# EAGLE schematic Schaltplan (EAGLE 9.6.2)

## Sheet 1 of 2
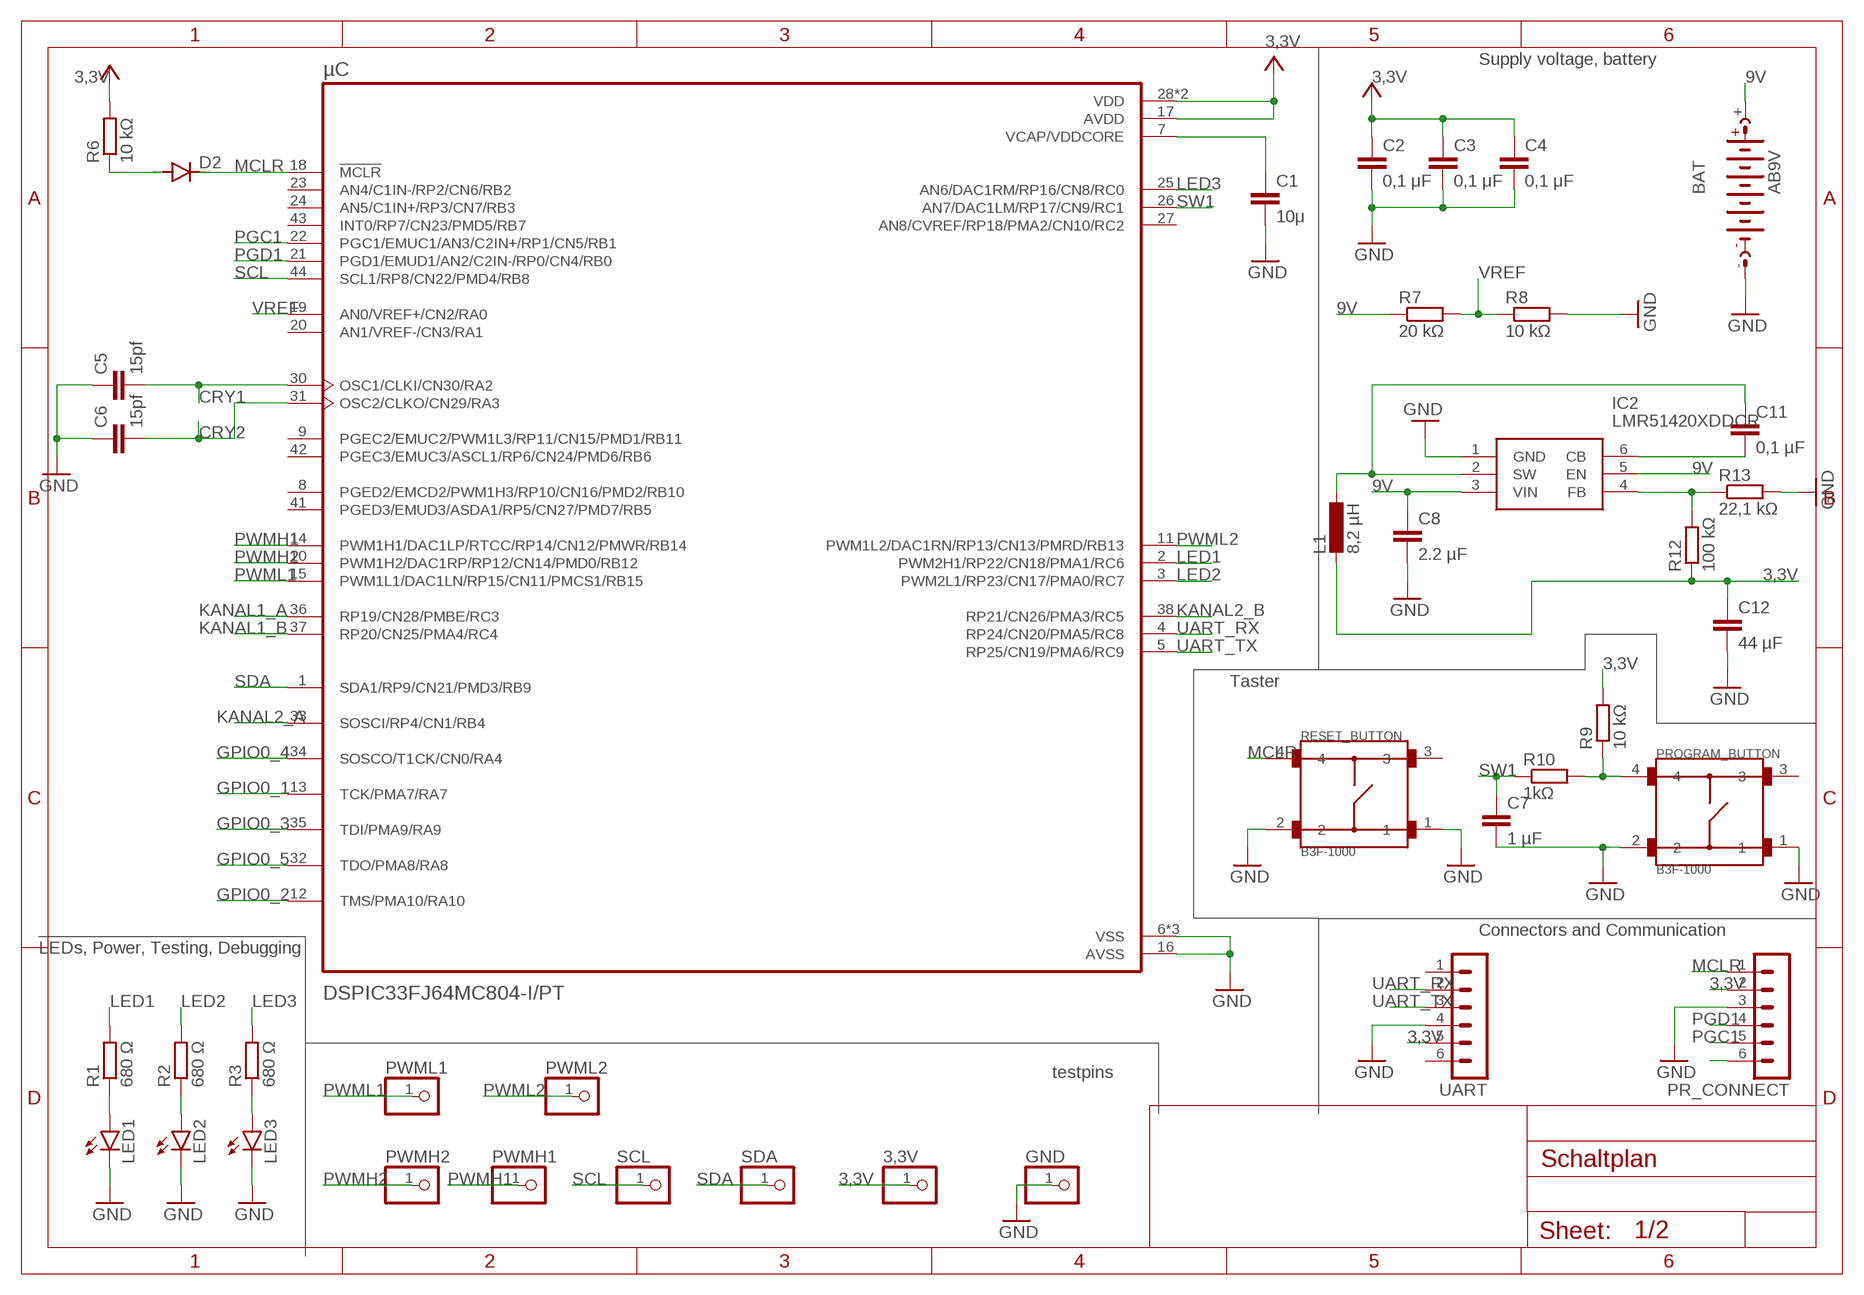
[diagram p0: schematic, sheet 1]

### Parts
3,3V  PINHD-1X1  [1X01]
BAT  AB9V  [AB9V]
C1  10μ  C-EUC0805  [C0805]
C2  0,1 μF  C-EUC0805  [C0805]
C3  0,1 μF  C-EUC0805  [C0805]
C4  0,1 μF  C-EUC0805  [C0805]
C5  15pf  C-EUC0805  [C0805]
C6  15pf  C-EUC0805  [C0805]
C7  1 µF  C-EUC0805  [C0805]
C8  2.2 µF  C-EUC0805  [C0805]
C11  0,1 µF  C-EUC0805  [C0805]
C12  44 µF  C-EUC0805  [C0805]
D2  DIODE-DO-214AC  [DO-214AC]
GND  PINHD-1X1  [1X01]
IC2  LMR51420XDDCR  [SOT95P280X110-6N]
L1  8,2 µH  L-EUL0201  [L0201]
LED1  LEDCHIPLED_0805  [CHIPLED_0805]
LED2  LEDCHIPLED_0805  [CHIPLED_0805]
LED3  LEDCHIPLED_0805  [CHIPLED_0805]
PR_CONNECT  MA06-1  [MA06-1]
PROGRAM_BUTTON  B3F-1000  [SW_B3F-1000]
PWMH1  PINHD-1X1  [1X01]
PWMH2  PINHD-1X1  [1X01]
PWML1  PINHD-1X1  [1X01]
PWML2  PINHD-1X1  [1X01]
R1  680 Ω  R-EU_R0805  [R0805]
R2  680 Ω  R-EU_R0805  [R0805]
R3  680 Ω  R-EU_R0805  [R0805]
R6  10 kΩ  R-EU_R0805  [R0805]
R7  20 kΩ  R-EU_R0805  [R0805]
R8  10 kΩ  R-EU_R0805  [R0805]
R9  10 kΩ  R-EU_R0805  [R0805]
R10  1kΩ  R-EU_R0805  [R0805]
R12  100 kΩ  R-EU_R0805  [R0805]
R13  22,1 kΩ  R-EU_R0805  [R0805]
RESET_BUTTON  B3F-1000  [SW_B3F-1000]
SCL  PINHD-1X1  [1X01]
SDA  PINHD-1X1  [1X01]
UART  MA06-1  [MA06-1]
µC  DSPIC33FJ64MC804-I/PT  [QFP80P1200X1200X120-44N]

### Nets
3,3V: 3,3V.1 C2.1 C3.1 C4.1 C12.1 L1.2 PR_CONNECT.2 R6.2 R9.2 R12.1 UART.5 µC.17(AVDD) µC.28(VDD) µC.40(VDD) ; supply symbol labelled VCC ; also sheet 2
9V: BAT.+ C8.1 IC2.3(VIN) IC2.5(EN) R7.1 ; also sheet 2
CRY1: C5.2 µC.30(OSC1/CLKI/CN30/RA2) ; also sheet 2
CRY2: C6.2 µC.31(OSC2/CLKO/CN29/RA3) ; also sheet 2
GND: BAT.- C1.2 C2.2 C3.2 C4.2 C5.1 C6.1 C7.2 C8.2 C12.2 GND.1 IC2.1(GND) LED1.C LED2.C LED3.C PR_CONNECT.3 PROGRAM_BUTTON.1 PROGRAM_BUTTON.2 R8.2 R13.2 RESET_BUTTON.1 RESET_BUTTON.2 UART.4 µC.6(VSS) µC.16(AVSS) µC.29(VSS) µC.39(VSS) ; also sheet 2
GPIO0_1: µC.13(TCK/PMA7/RA7) ; also sheet 2
GPIO0_2: µC.12(TMS/PMA10/RA10) ; also sheet 2
GPIO0_3: µC.35(TDI/PMA9/RA9) ; also sheet 2
GPIO0_4: µC.34(SOSCO/T1CK/CN0/RA4) ; also sheet 2
GPIO0_5: µC.32(TDO/PMA8/RA8) ; also sheet 2
KANAL1_A: µC.36(RP19/CN28/PMBE/RC3) ; also sheet 2
KANAL1_B: µC.37(RP20/CN25/PMA4/RC4) ; also sheet 2
KANAL2_A: µC.33(SOSCI/RP4/CN1/RB4) ; also sheet 2
KANAL2_B: µC.38(RP21/CN26/PMA3/RC5) ; also sheet 2
LED1: R1.2 µC.2(PWM2H1/RP22/CN18/PMA1/RC6)
LED2: R2.2 µC.3(PWM2L1/RP23/CN17/PMA0/RC7)
LED3: R3.2 µC.25(AN6/DAC1RM/RP16/CN8/RC0)
MCLR: D2.C PR_CONNECT.1 RESET_BUTTON.4 µC.18(!MCLR)
N$1: C1.1 µC.7(VCAP/VDDCORE)
N$2: PROGRAM_BUTTON.4 R9.1 R10.2
N$3: LED2.A R2.1
N$4: LED1.A R1.1
N$5: C11.2 IC2.6(CB)
N$7: PR_CONNECT.6
N$8: LED3.A R3.1
N$10: D2.A R6.1
N$11: C11.1 IC2.2(SW) L1.1
N$13: IC2.4(FB) R12.2 R13.1
PGC1: PR_CONNECT.5 µC.22(PGC1/EMUC1/AN3/C2IN+/RP1/CN5/RB1)
PGD1: PR_CONNECT.4 µC.21(PGD1/EMUD1/AN2/C2IN-/RP0/CN4/RB0)
PWMH1: PWMH1.1 µC.14(PWM1H1/DAC1LP/RTCC/RP14/CN12/PMWR/RB14) ; also sheet 2
PWMH2: PWMH2.1 µC.10(PWM1H2/DAC1RP/RP12/CN14/PMD0/RB12) ; also sheet 2
PWML1: PWML1.1 µC.15(PWM1L1/DAC1LN/RP15/CN11/PMCS1/RB15) ; also sheet 2
PWML2: PWML2.1 µC.11(PWM1L2/DAC1RN/RP13/CN13/PMRD/RB13) ; also sheet 2
SCL: SCL.1 µC.44(SCL1/RP8/CN22/PMD4/RB8) ; also sheet 2
SDA: SDA.1 µC.1(SDA1/RP9/CN21/PMD3/RB9) ; also sheet 2
SW1: C7.1 R10.1 µC.26(AN7/DAC1LM/RP17/CN9/RC1)
UART_RX: UART.2 µC.4(RP24/CN20/PMA5/RC8)
UART_TX: UART.3 µC.5(RP25/CN19/PMA6/RC9)
VREF: R7.2 R8.1 µC.19(AN0/VREF+/CN2/RA0)
Unconnected: PROGRAM_BUTTON.3 RESET_BUTTON.3 UART.1 UART.6 µC.8(PGED2/EMCD2/PWM1H3/RP10/CN16/PMD2/RB10) µC.9(PGEC2/EMUC2/PWM1L3/RP11/CN15/PMD1/RB11) µC.20(AN1/VREF-/CN3/RA1) µC.23(AN4/C1IN-/RP2/CN6/RB2) µC.24(AN5/C1IN+/RP3/CN7/RB3) µC.27(AN8/CVREF/RP18/PMA2/CN10/RC2) µC.41(PGED3/EMUD3/ASDA1/RP5/CN27/PMD7/RB5) µC.42(PGEC3/EMUC3/ASCL1/RP6/CN24/PMD6/RB6) µC.43(INT0/RP7/CN23/PMD5/RB7)

### Notes on the sheet
- Supply voltage, battery
- Taster
- Connectors and Communication
- LEDs, Power, Testing, Debugging
- testpins

## Sheet 2 of 2
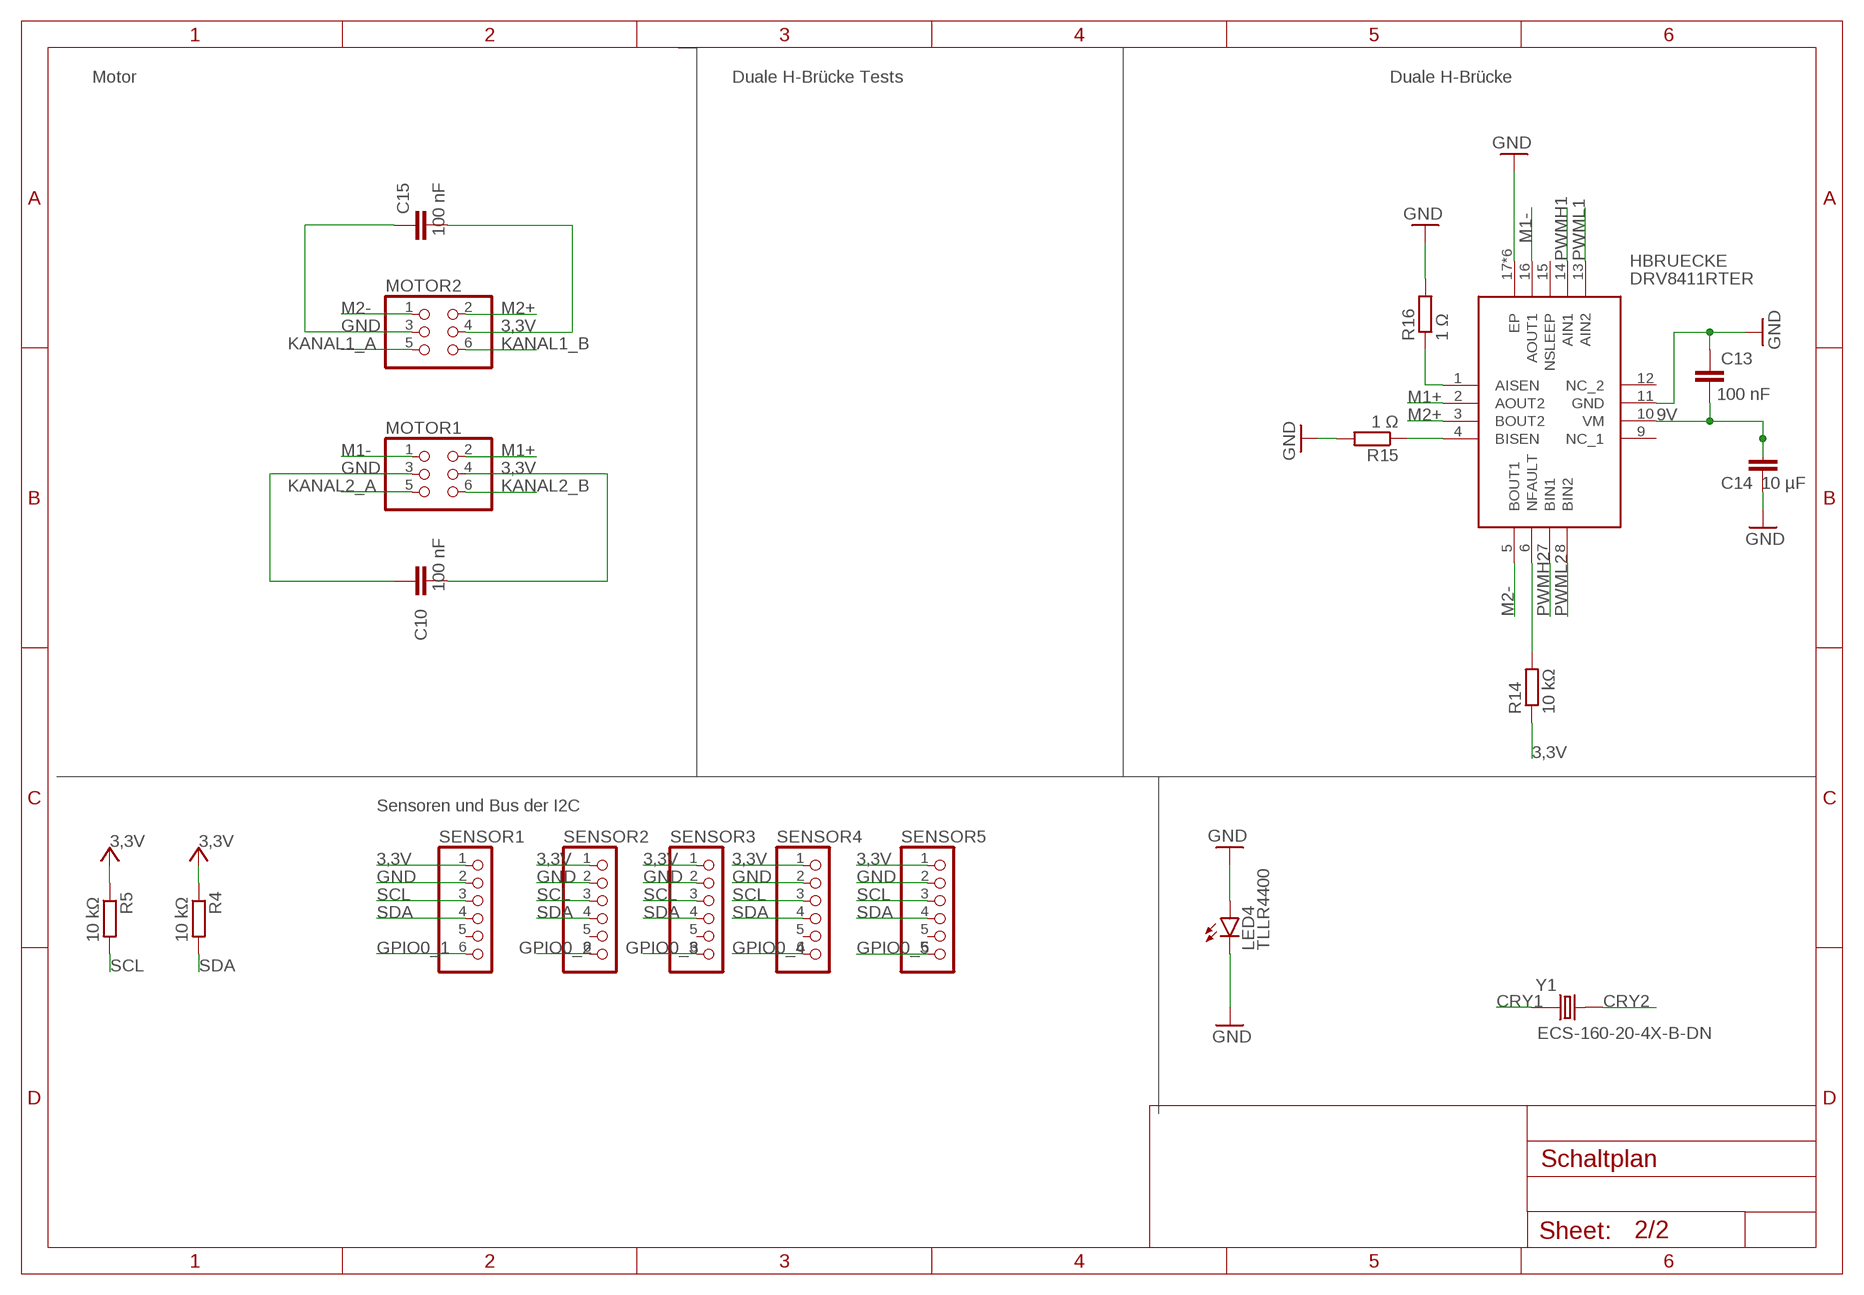
[diagram p1: schematic, sheet 2]

### Parts
C10  100 nF  C-EUC0805  [C0805]
C13  100 nF  C-EUC0805  [C0805]
C14  10 µF  C-EUC0805  [C0805]
C15  100 nF  C-EUC0805  [C0805]
HBRUECKE  DRV8411RTER  [QFN50P300X300X80-17N]
LED4  TLLR4400  [LED3MM]
MOTOR1  PINHD-2X3  [2X03]
MOTOR2  PINHD-2X3  [2X03]
R4  10 kΩ  R-EU_R0805  [R0805]
R5  10 kΩ  R-EU_R0805  [R0805]
R14  10 kΩ  R-EU_R0805  [R0805]
R15  1 Ω  R-EU_R0805  [R0805]
R16  1 Ω  R-EU_R0805  [R0805]
SENSOR1  PINHD-1X6  [1X06]
SENSOR2  PINHD-1X6  [1X06]
SENSOR3  PINHD-1X6  [1X06]
SENSOR4  PINHD-1X6  [1X06]
SENSOR5  PINHD-1X6  [1X06]
Y1  ECS-160-20-4X-B-DN  [XTAL_ECS-160-20-4X-B-DN]

### Nets
3,3V: C10.1 C15.1 MOTOR1.4 MOTOR2.4 R4.1 R5.1 R14.1 SENSOR1.1 SENSOR2.1 SENSOR3.1 SENSOR4.1 SENSOR5.1 ; supply symbol labelled VCC ; also sheet 1
9V: C13.1 C14.2 HBRUECKE.10(VM) ; also sheet 1
CRY1: Y1.1 ; also sheet 1
CRY2: Y1.2 ; also sheet 1
GND: C10.2 C13.2 C14.1 C15.2 HBRUECKE.11(GND) HBRUECKE.17(EP) HBRUECKE.PAD1(EP) HBRUECKE.PAD2(EP) HBRUECKE.PAD3(EP) HBRUECKE.PAD4(EP) HBRUECKE.PAD5(EP) LED4.A LED4.K(C) MOTOR1.3 MOTOR2.3 R15.2 R16.2 SENSOR1.2 SENSOR2.2 SENSOR3.2 SENSOR4.2 SENSOR5.2 ; also sheet 1
GPIO0_1: SENSOR1.6 ; also sheet 1
GPIO0_2: SENSOR2.6 ; also sheet 1
GPIO0_3: SENSOR3.6 ; also sheet 1
GPIO0_4: SENSOR4.6 ; also sheet 1
GPIO0_5: SENSOR5.6 ; also sheet 1
KANAL1_A: MOTOR2.5 ; also sheet 1
KANAL1_B: MOTOR2.6 ; also sheet 1
KANAL2_A: MOTOR1.5 ; also sheet 1
KANAL2_B: MOTOR1.6 ; also sheet 1
M1+: HBRUECKE.2(AOUT2) MOTOR1.2
M1-: HBRUECKE.16(AOUT1) MOTOR1.1
M2+: HBRUECKE.3(BOUT2) MOTOR2.2
M2-: HBRUECKE.5(BOUT1) MOTOR2.1
N$12: HBRUECKE.6(NFAULT) R14.2
N$14: HBRUECKE.1(AISEN) R16.1
N$16: HBRUECKE.4(BISEN) R15.1
PWMH1: HBRUECKE.14(AIN1) ; also sheet 1
PWMH2: HBRUECKE.7(BIN1) ; also sheet 1
PWML1: HBRUECKE.13(AIN2) ; also sheet 1
PWML2: HBRUECKE.8(BIN2) ; also sheet 1
SCL: R5.2 SENSOR1.3 SENSOR2.3 SENSOR3.3 SENSOR4.3 SENSOR5.3 ; also sheet 1
SDA: R4.2 SENSOR1.4 SENSOR2.4 SENSOR3.4 SENSOR4.4 SENSOR5.4 ; also sheet 1
Unconnected: HBRUECKE.9(NC_1) HBRUECKE.12(NC_2) HBRUECKE.15(NSLEEP) SENSOR1.5 SENSOR2.5 SENSOR3.5 SENSOR4.5 SENSOR5.5

### Notes on the sheet
- Motor | Duale H-Brücke Tests | Duale H-Brücke
- Sensoren und Bus der I2C

## Library data of the parts
3,3V GND PWMH1 PWMH2 PWML1 PWML2 SCL SDA = pinhead:PINHD-1X1: PIN HEADER
BAT = battery:AB9V: 9-V BATTERY CLIP
C1-C8 C10-C15 = rcl:C-EU: CAPACITOR, European symbol; SPICEPREFIX: C
D2 = diode:DIODE-: DIODE
HBRUECKE = DRV8411RTER:DRV8411RTER: Motor / Motion / Ignition Controllers & Drivers 1.65-V to 11-V, 4-A, dual H-bridge motor driver with current regulation Source: Datasheet <https://www.ti.com/lit/ds/symlink/drv8411.pdf?ts=1669086964917&ref_url=https%3A%2F%2Fwww.ti.com%2Fproduct%2FDRV8411>; DESCRIPTION: Motor / Motion / Ignition Controllers & Drivers 1.65-V to 11-V, 4-A, dual H-bridge motor driver with current regulation; HEIGHT: 0.8mm; MANUFACTURER_NAME: Texas Instruments; MANUFACTURER_PART_NUMBER: DRV8411RTER
IC2 = LMR51420XDDCR:LMR51420XDDCR: Switching Voltage Regulators SIMPLE SWITCHER power converter 4.5-V to 36-V, 2-A, synchronous buck with 40-uA IQ Source: Datasheet <https://www.ti.com/lit/ds/symlink/lmr51420.pdf?ts=1663231243064>; ARROW_PART_NUMBER: LMR51420XDDCR; ARROW_PRICE-STOCK: https://www.arrow.com/en/products/lmr51420xddcr/texas-instruments?region=nac; DESCRIPTION: Switching Voltage Regulators SIMPLE SWITCHER power converter 4.5-V to 36-V, 2-A, synchronous buck with 40-uA IQ; HEIGHT: 1.1mm; MANUFACTURER_NAME: Texas Instruments; MANUFACTURER_PART_NUMBER: LMR51420XDDCR; MOUSER_PART_NUMBER: 595-LMR51420XDDCR; MOUSER_PRICE-STOCK: https://www.mouser.co.uk/ProductDetail/Texas-Instruments/LMR51420XDDCR?qs=vvQtp7zwQdN6fBqQU4azxw%3D%3D
L1 = rcl:L-EU: INDUCTOR, European symbol; SPICEPREFIX: L
LED1-LED3 = led:LED: LED OSRAM: - CHIPLED LG R971, LG N971, LY N971, LG Q971, LY Q971, LO R971, LY R971 LH N974, LH R974 LS Q976, LO Q976, LY Q976 LO Q996 - Hyper CHIPLED LW Q18S LB Q993, LB Q99A, LB R99A - SideLED LS A670, LO A670, LY A670, LG A670, LP A670 LB A673, LV A673, LT A673, LW A673 LH A674 LY A675 LS A676, LA A676, LO A676, LY A676, LW A676 LS A679, LY A679, LG A679 - Hyper Micro SIDELED® LS Y876, LA Y876, LO Y876, LY Y876 LT Y87S - SmartLED LW L88C, LW L88S LB L89C, LB L89S, LG L890 LS L89K, LO L89K, LY L89K LS L896, LA L896, LO L896, LY L896 - TOPLED LS T670, LO T670, LY T670, LG T670, LP T670 LSG T670, LSP T670, LSY T670, LOP T670, LYG T670 LG T671, LOG T671, LSG T671 LB T673, LV T673, LT T673, LW T673 LH T674 LS T676, LA T676, LO T676, LY T676, LB T676, LH T676, LSB T676, LW T676 LB T67C, LV T67C, LT T67C, LS T67K, LO T67K, LY T67K, LW E67C LS E67B, LA E67B, LO E67B, LY E67B, LB E67C, LV E67C, LT E67C LW T67C LS T679, LY T679, LG T679 LS T770, LO T770, LY T770, LG T770, LP T770 LB T773, LV T773, LT T773, LW T773 LH T774 LS E675, LA E675, LY E675, LS T675 LS T776, LA T776, LO T776, LY T776, LB T776 LHGB T686 LT T68C, LB T68C - Hyper Mini TOPLED® LB M676 - Mini TOPLED Santana® LG M470 LS M47K, LO M47K, LY M47K Source: http://www.osram.convergy.de LUXEON: - LUMILED® LXK2-PW12-R00, LXK2-PW12-S00, LXK2-PW14-U00, LXK2-PW14-V00 LXK2-PM12-R00, LXK2-PM12-S00, LXK2-PM14-U00 LXK2-PE12-Q00, LXK2-PE12-R00, LXK2-PE12-S00, LXK2-PE14-T00, LXK2-PE14-U00 LXK2-PB12-K00, LXK2-PB12-L00, LXK2-PB12-M00, LXK2-PB14-N00, LXK2-PB14-P00, LXK2-PB14-Q00 LXK2-PR12-L00, LXK2-PR12-M00, LXK2-PR14-Q00, LXK2-PR14-R00 LXK2-PD12-Q00, LXK2-PD12-R00, LXK2-PD12-S00 LXK2-PH12-R00, LXK2-PH12-S00 LXK2-PL12-P00, LXK2-PL12-Q00, LXK2-PL12-R00 Source: www.luxeon.com KINGBRIGHT: KA-3528ASYC Source: www.kingbright.com
LED4 = led:TLLR4400: Low Current (2mA) LED 3 mm Tinted Diffused Package color RED Source: Data sheet <http://www.farnell.com/datasheets/391100.pdf>; MF: VISHAY SEMICONDUCTOR; OC_FARNELL: 1612437
MOTOR1 MOTOR2 = pinhead:PINHD-2X3: PIN HEADER
PR_CONNECT UART = con-lstb:MA06-1: PIN HEADER; OC_FARNELL: unknown; OC_NEWARK: unknown
PROGRAM_BUTTON RESET_BUTTON = B3F-1000:B3F-1000: Switch, FLUX TIGHT MECHANICAL KEYSwitch, , 50MA@24VDC, NO GROUND TERM., FLAT PLUNG Check availability <https://pricing.snapeda.com/parts/B3F-1000/Omron/view-part?ref=eda>; AVAILABILITY: In Stock; DESCRIPTION: Tactile Switch SPST-NO Top Actuated Through Hole; MF: Omron; MP: B3F-1000; PACKAGE: None; PRICE: None; PURCHASE-URL: https://pricing.snapeda.com/search/part/B3F-1000/?ref=eda
R1-R10 R12-R16 = rcl:R-EU_: RESISTOR, European symbol; SPICEPREFIX: R
SENSOR1-SENSOR5 = pinhead:PINHD-1X6: PIN HEADER
Y1 = ECS-160-20-4X-B-DN:ECS-160-20-4X-B-DN: Check availability <https://pricing.snapeda.com/parts/ECS-160-20-4X-B-DN/ECS%20Inc./view-part?ref=eda>; AVAILABILITY: In Stock; DESCRIPTION: 16 MHz ±30ppm Crystal 20pF 40 Ohms HC-49/US; MF: ECS Inc.; MP: ECS-160-20-4X-B-DN; PACKAGE: HC-49US ECS Inc.; PRICE: None; PURCHASE-URL: https://pricing.snapeda.com/search/part/ECS-160-20-4X-B-DN/?ref=eda
µC = DSPIC33FJ64MC804-I_PT:DSPIC33FJ64MC804-I/PT: Check availability <https://pricing.snapeda.com/parts/DSPIC33FJ64MC804-I/PT/Microchip/view-part?ref=eda>; AVAILABILITY: In Stock; DESCRIPTION: dsPIC dsPIC™ 33F Microcontroller IC 16-Bit 40 MIPs 64KB (64K x 8) FLASH 44-TQFP (10x10); MF: Microchip; MP: DSPIC33FJ64MC804-I/PT; PACKAGE: TQFP-44 Microchip; PRICE: None; PURCHASE-URL: https://pricing.snapeda.com/search/part/DSPIC33FJ64MC804-I/PT/?ref=eda